# EAGLE design Solar Charger Adafruit (EAGLE 9.3.1)
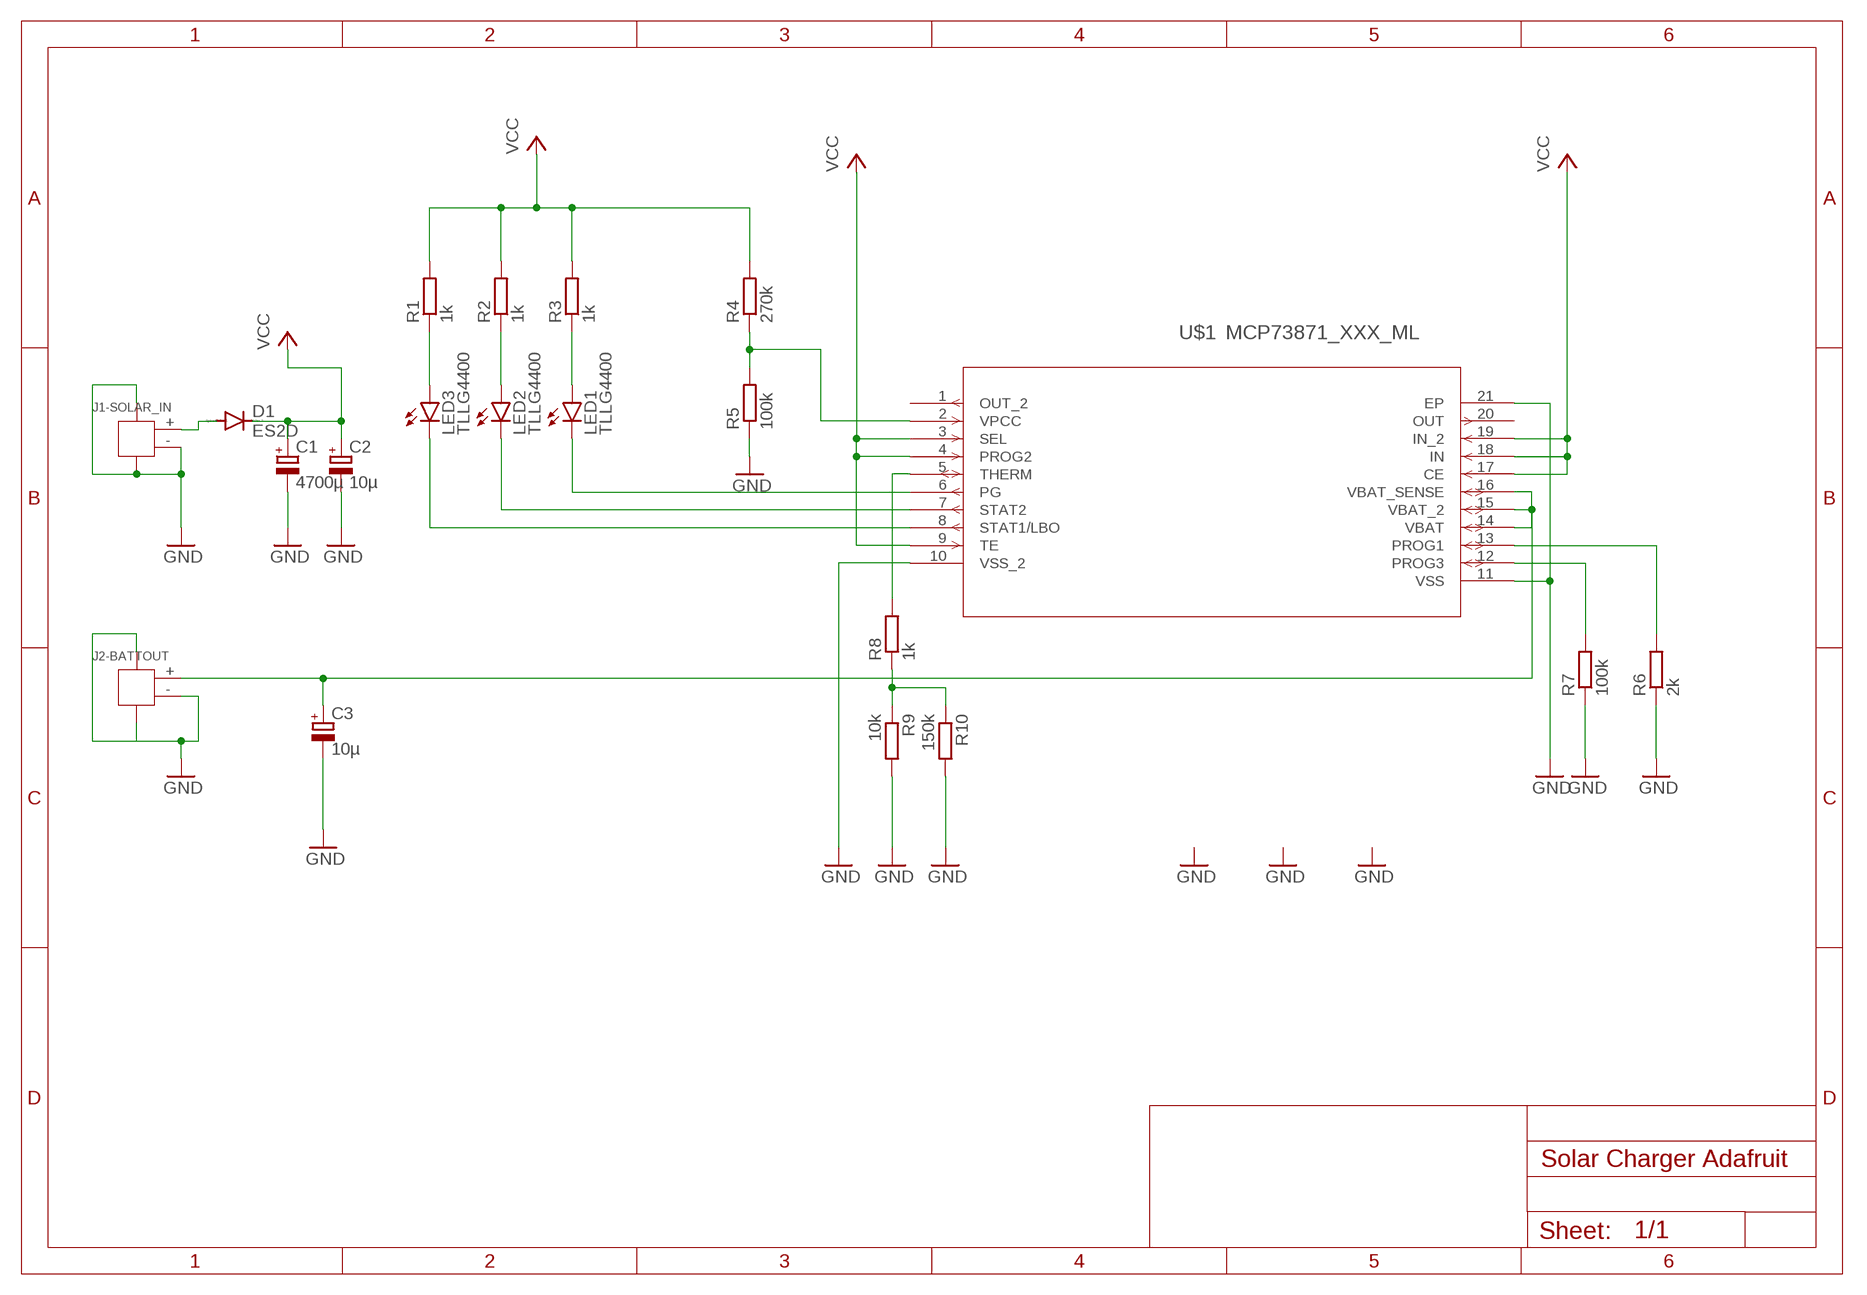
[diagram p0: schematic, sheet 1]

## Parts
C1  4700µ  CPOL-EUC/6032-28R  [C/6032-28R]
C2  10µ  CPOL-EUC/6032-28R  [C/6032-28R]
C3  10µ  CPOL-EUC/6032-28R  [C/6032-28R]
D1  ES2D  [SMB]
J1-SOLAR_IN  CONN-HEADER-SMD-PH-SIDE-(2P-2.0MM)  [HW2-SMD-2.0-90D]
J2-BATTOUT  CONN-HEADER-SMD-PH-SIDE-(2P-2.0MM)  [HW2-SMD-2.0-90D]
LED1  TLLG4400  [LED3MM]
LED2  TLLG4400  [LED3MM]
LED3  TLLG4400  [LED3MM]
R1  1k  R-EU_R0603  [R0603]
R2  1k  R-EU_R0603  [R0603]
R3  1k  R-EU_R0603  [R0603]
R4  270k  R-EU_R0603  [R0603]
R5  100k  R-EU_R0603  [R0603]
R6  2k  R-EU_R0603  [R0603]
R7  100k  R-EU_R0603  [R0603]
R8  1k  R-EU_R0603  [R0603]
R9  10k  R-EU_R0603  [R0603]
R10  150k  R-EU_R0603  [R0603]
U$1  MCP73871_XXX_ML  [QFN20_4X4MC]

## Nets
GND: C1.- C2.- C3.- J1-SOLAR_IN.3 J1-SOLAR_IN.4 J1-SOLAR_IN.- J2-BATTOUT.3 J2-BATTOUT.4 J2-BATTOUT.- R5.1 R6.1 R7.1 R9.2 R10.2 U$1.10(VSS_2) U$1.11(VSS) U$1.21(EP)
N$1: LED1.A R3.1
N$2: LED2.A R2.1
N$3: LED3.A R1.1
N$4: LED1.K(C) U$1.6(PG)
N$5: LED2.K(C) U$1.7(STAT2)
N$6: LED3.K(C) U$1.8(STAT1/LBO)
N$7: R4.1 R5.2 U$1.2(VPCC)
N$8: R7.2 U$1.12(PROG3)
N$9: R8.1 R9.1 R10.1
N$10: R6.2 U$1.13(PROG1)
N$11: C3.+ J2-BATTOUT.+ U$1.14(VBAT) U$1.15(VBAT_2) U$1.16(VBAT_SENSE)
N$13: D1.A J1-SOLAR_IN.+
N$14: R8.2 U$1.5(THERM)
VCC: C1.+ C2.+ D1.C R1.2 R2.2 R3.2 R4.2 U$1.3(SEL) U$1.4(PROG2) U$1.9(TE) U$1.17(CE) U$1.18(IN) U$1.19(IN_2)
Unconnected: U$1.1(OUT_2) U$1.20(OUT)

## Library data of the parts
C1-C3 = rcl:CPOL-EU: POLARIZED CAPACITOR, European symbol; SPICEPREFIX: C
D1 = diode:ES2D: DIODE super fast rectifier, 2 A
J1-SOLAR_IN J2-BATTOUT = connectors2:CONN-HEADER-SMD-PH-SIDE-(2P-2.0MM): 320110026; VALUE: 2P-2.0-90D-SMD
LED1-LED3 = led:TLLG4400: Low Current (2mA) LED 3 mm Tinted Diffused Package color GREEN Source: Data sheet <http://www.farnell.com/datasheets/391098.pdf>; MF: VISHAY SEMICONDUCTOR; OC_FARNELL: 1612435
R1-R10 = rcl:R-EU_: RESISTOR, European symbol; SPICEPREFIX: R
U$1 = MCP73871:MCP73871_XXX_ML

## Board
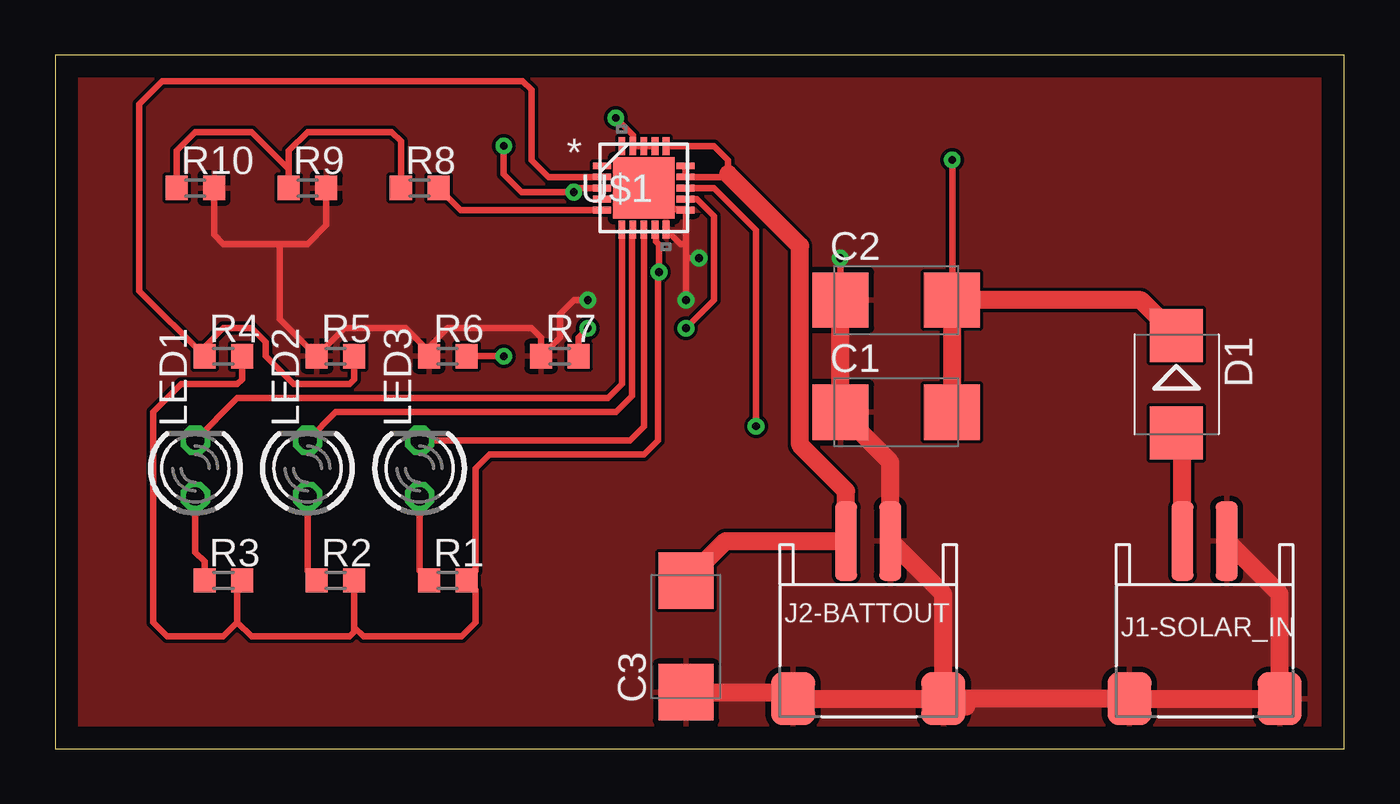
[diagram p1: board, top side]
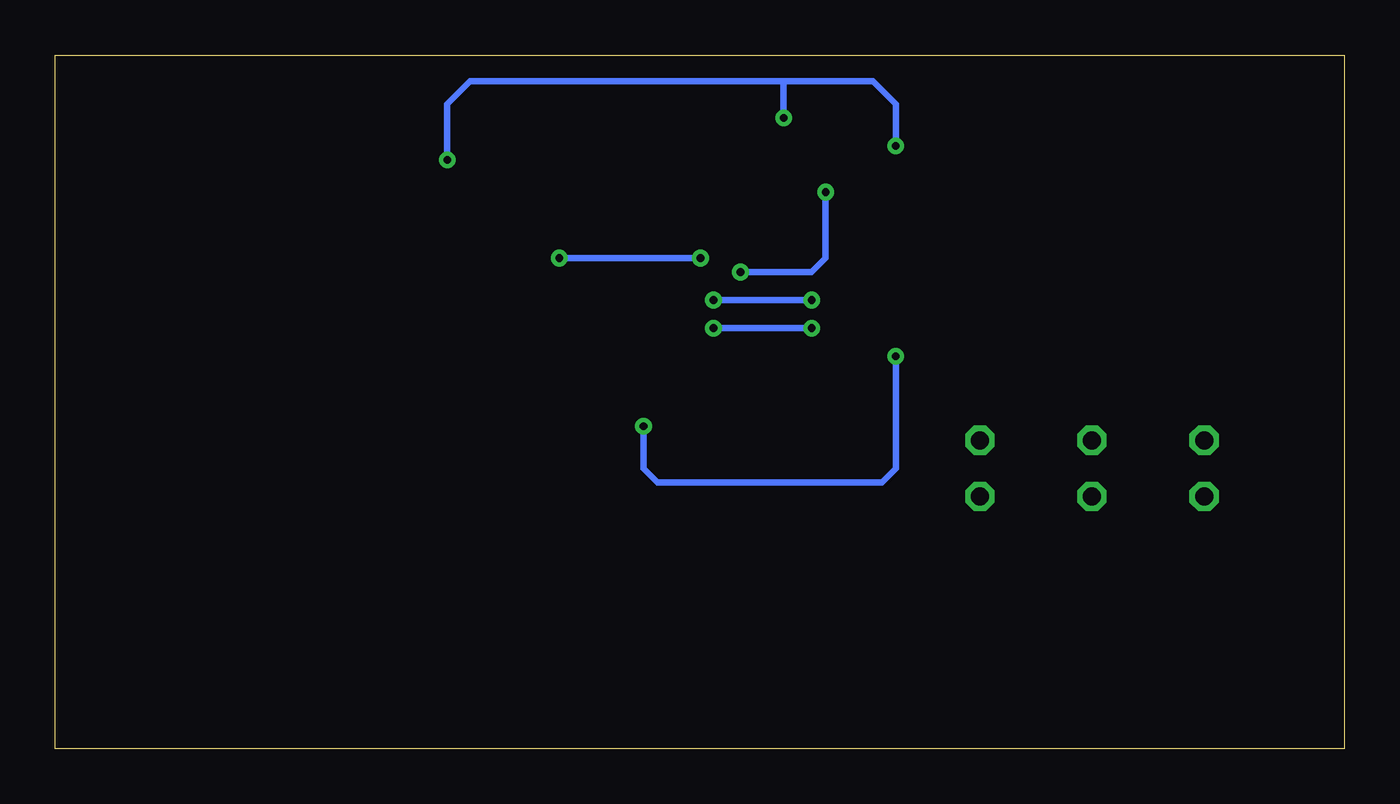
[diagram p2: board, bottom side, seen from below]

Size 58.4 x 31.42 mm. Coordinates in mm from the lower left corner, seen from the top.
Outline: 0,0 58.4,0 58.4,31.42 0,31.42 0,0
Copper layers (1*16): Top 0.035mm / dielectric 1.5mm / Bottom 0.035mm
Design rules "default": minimum track width 6mil, minimum drill 0.35mm, track to track 6mil, track to pad 6mil, pad to pad 6mil, via to via 6mil, smd to smd 6mil, copper to edge 40mil, drill to drill 6mil, minimum pad ring 10mil, minimum via ring 8mil, stop-mask expansion 4mil, vias tented up to drill 0mil, thermal gap 10mil

### Footprints (pad centres in the part's own frame; a part is rotated, then mirrored left to right if it is on the bottom)
C/6032-28R = smd 2.55 x 2.5: + 2.525,0; - -2.525,0
SMB = smd 2.4 x 2.4: A 2.2,0; C -2.2,0
HW2-SMD-2.0-90D = smd 2 x 2.4: 3 3.4,-2.181; 4 -3.4,-2.181 | smd 1 x 3.6: + -1,4.953; - 1,4.953
LED3MM = drill 0.813 octagon: A -1.27,0; K 1.27,0
R0603 = smd 1 x 1.1: 1 -0.85,0; 2 0.85,0
QFN20_4X4MC = smd 0.813 x 0.305: 1 -1.892,1; 2 -1.892,0.5; 3 -1.892,0; 4 -1.892,-0.5; 5 -1.892,-1; 11 1.892,-1; 12 1.892,-0.5; 13 1.892,0; 14 1.892,0.5; 15 1.892,1 | smd 0.305 x 0.813: 6 -1,-1.892; 7 -0.5,-1.892; 8 0,-1.892; 9 0.5,-1.892; 10 1,-1.892; 16 1,1.892; 17 0.5,1.892; 18 0,1.892; 19 -0.5,1.892; 20 -1,1.892 | smd 2.794 x 2.794: 21 0,0

### Placement (x,y rotation side)
C1  38.1,15.24 0 top
C2  38.1,20.32 0 top
C3  28.57,5.08 90 top
D1  50.8,16.51 270 top
J1-SOLAR_IN  52.07,4.45 0 top
J2-BATTOUT  36.83,4.45 0 top
LED1  6.35,12.7 90 top
LED2  11.43,12.7 90 top
LED3  16.51,12.7 90 top
R1  17.78,7.62 0 top
R2  12.7,7.62 0 top
R3  7.62,7.62 0 top
R4  7.62,17.78 0 top
R5  12.7,17.78 0 top
R6  17.78,17.78 0 top
R7  22.86,17.78 0 top
R8  16.51,25.4 0 top
R9  11.43,25.4 0 top
R10  6.35,25.4 0 top
U$1  26.67,25.4 0 top

### Tracks (layer width: path | path; a pad name or v marks a point on that pad's centre or on a via)
GND  (via drill 0.35)
  Top 0.305: R10.2 7.2,23.28 7.62,22.86 10.16,22.86 | 10.16,22.86 11.43,22.86 12.28,23.71 R9.2 | 10.16,22.86 10.16,19.47 R5.1 13.12,19.05 15.88,19.05 16.93,18 R6.1 16.93,18.2 17.78,19.05 21.59,19.05 22.01,18.63 R7.1 22.86,18.63 22.86,19.68 23.5,20.32 v24.13,20.32 | v28.57,20.32 28.57,22.23 | 28.57,22.23 28.57,22.86 | 28.57,22.86 28.57,24.39 U$1.11 28.52,24.44 28.03,24.44 27.85,24.62 27.85,25.11 27.56,25.4 U$1.21 | 28.57,22.23 v29.16,22.23 29.21,22.23 | v35.56,22.23 35.58,22.21 C2.- | U$1.10 28.32,22.86 28.57,22.86
  Top 0.813: C2.- C1.- 37.83,12.98 J2-BATTOUT.- 40.23,7 J2-BATTOUT.3 | C3.- 33.14,2.56 J2-BATTOUT.4 J2-BATTOUT.3 | 41.27,1.91 40.59,1.91 J2-BATTOUT.3 | J2-BATTOUT.3 J1-SOLAR_IN.4 J1-SOLAR_IN.3 55.47,7 J1-SOLAR_IN.-
  Bottom 0.305: v24.13,20.32 v28.57,20.32 | v29.16,22.23 v35.56,22.23
  pour Top: 0,0 0,31.75 58.42,31.75 58.42,0
N$1
  Top 0.305: R3.1 6.77,8.47 6.35,8.89 LED1.A
N$2
  Top 0.305: R2.1 11.43,8.04 LED2.A
N$3
  Top 0.305: R1.1 16.51,8.04 LED3.A
N$4
  Top 0.305: LED1.K 8.26,15.88 25.04,15.88 25.67,16.51 U$1.6 | U$1.6
N$5
  Top 0.305: LED2.K 12.7,15.24 25.4,15.24 26.13,15.97 26.13,23.46 U$1.7
N$6
  Top 0.305: LED3.K 26.04,13.97 26.67,14.61 U$1.8
N$7
  Top 0.305: U$1.2 22.36,25.9 21.59,26.67 21.59,29.84 21.18,30.25 4.85,30.25 3.81,29.21 3.81,20.74 R4.1 6.77,18.2 7.62,19.05 8.89,19.05 9.53,18.41 9.53,17.78 10.79,16.51 13.34,16.51 13.55,16.73 R5.2
N$8  (via drill 0.35)
  Top 0.305: R7.2 23.71,18.63 v24.13,19.05 | v28.57,19.05 29.84,20.32 29.84,24.13 29.07,24.9 U$1.12
  Bottom 0.305: v24.13,19.05 v28.57,19.05
N$9
  Top 0.305: R10.1 5.5,27.09 6.35,27.94 8.89,27.94 10.58,26.25 R9.1 10.58,27.09 11.43,27.94 15.24,27.94 15.66,27.52 R8.1
N$10  (via drill 0.35)
  Top 0.305: R6.2 v20.32,17.78 | v31.75,14.61 31.75,23.5 29.84,25.4 U$1.13
  Bottom 0.305: v20.32,17.78 20.32,12.7 20.95,12.06 31.11,12.06 31.75,12.7 v31.75,14.61
N$11
  Top 0.305: U$1.16 29.83,27.29 29.84,27.3 30.48,26.67 30.48,26.04 30.34,25.9 U$1.14 U$1.15
  Top 0.813: 30.48,26.04 33.74,22.77 33.74,13.76 35.83,11.67 J2-BATTOUT.+ 30.37,9.4 C3.+
N$13
  Top 0.813: J1-SOLAR_IN.+ 51.07,14.04 D1.A
N$14
  Top 0.305: R8.2 18.36,24.4 U$1.5
VCC  (via drill 0.35)
  Top 0.305: 8.26,5.71 8.89,5.08 13.34,5.08 13.55,5.29 R2.2 13.55,5.5 13.97,5.08 18.41,5.08 19.05,5.71 19.05,7.2 R1.2 19.05,8.04 19.05,12.7 19.68,13.34 26.67,13.34 27.3,13.97 27.3,21.54 v27.35,21.59 27.35,22.84 27.21,22.98 27.21,23.46 U$1.9 | R3.2 8.26,7.41 8.26,5.71 | 8.26,5.71 7.62,5.08 5.08,5.08 4.45,5.71 4.45,15.24 5.71,16.51 8.26,16.51 8.47,16.73 R4.2 | U$1.4 U$1.3 23.68,25.4 v23.5,25.22 21.14,25.22 20.32,26.04 v20.32,27.3 | U$1.17 U$1.18 U$1.19 26.17,27.8 v25.4,28.57 | v40.64,26.67 40.64,20.34 C2.+
  Top 0.813: C1.+ C2.+ 49.19,20.32 D1.C
  Bottom 0.305: v27.35,21.59 24.13,21.59 23.5,22.23 v23.5,25.22 23.5,25.4 | v20.32,27.3 20.32,29.21 21.36,30.25 25.4,30.25 | 25.4,30.25 39.6,30.25 40.64,29.21 v40.64,26.67 | v25.4,28.57 25.4,30.25